# EAGLE design kulgurpowerproto2 (EAGLE 6.3)

## Sheet 1 of 3
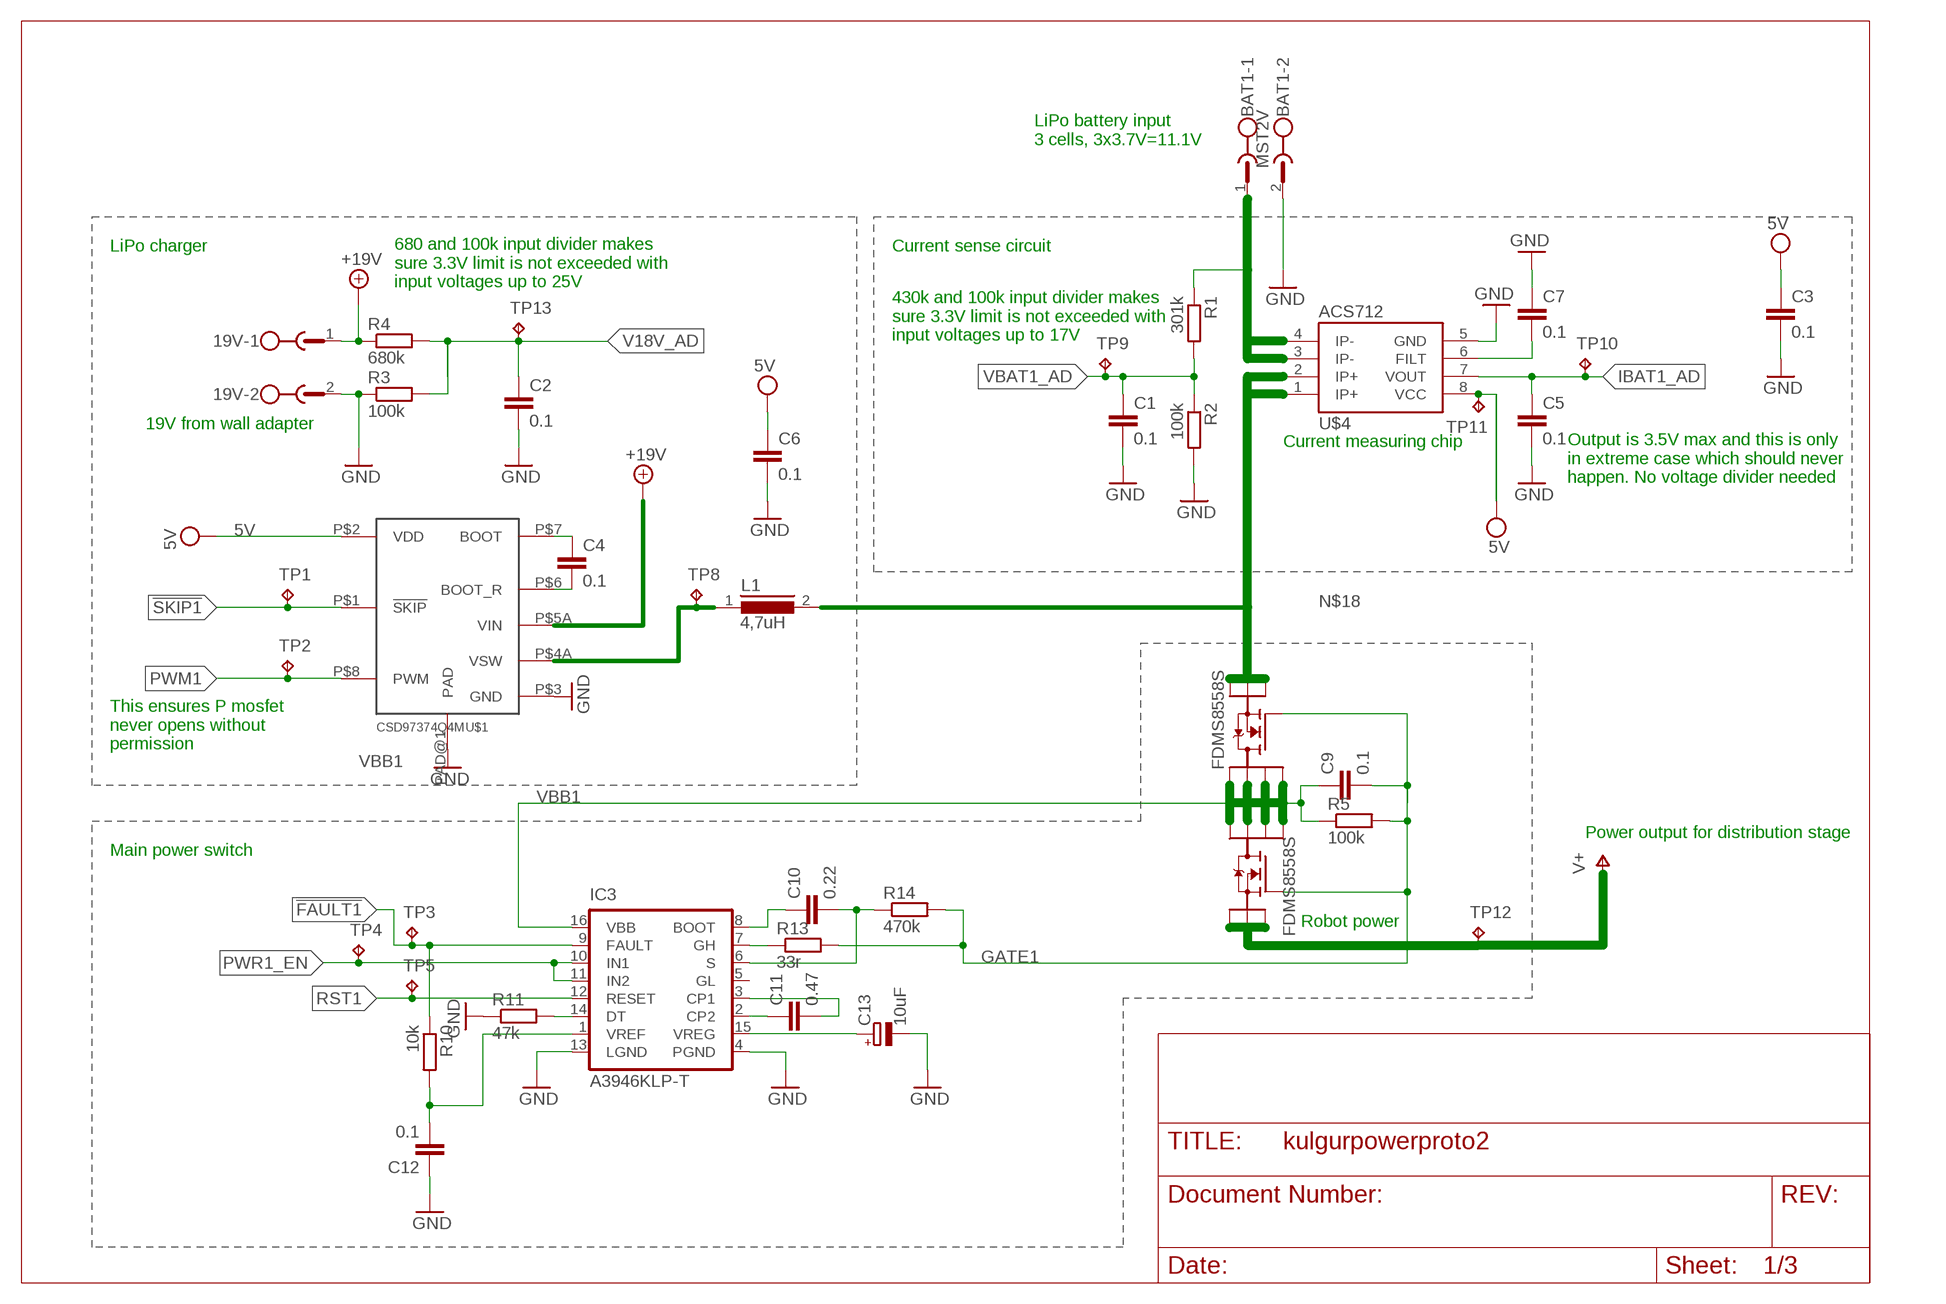
[diagram p0: schematic, sheet 1]

### Parts
19V  MST2V  [MSTBV2]
BAT1  MST2V  [MSTBV2]
C1  0.1  C-EUC0603  [C0603]
C2  0.1  C-EUC0603  [C0603]
C3  0.1  C-EUC0603  [C0603]
C4  0.1  C-EUC0603  [C0603]
C5  0.1  C-EUC0603  [C0603]
C6  0.1  C-EUC0603  [C0603]
C7  0.1  C-EUC0603  [C0603]
C9  0.1  C-EUC0603  [C0603]
C10  0.22  C-EUC0603  [C0603]
C11  0.47  C-EUC0603  [C0603]
C12  0.1  C-EUC0603  [C0603]
C13  10uF  CPOL-EUA/3216-18R  [A/3216-18R]
IC3  A3946KLP-T  [TSSOP16E]
L1  4,7uH  DR73  [DR73]
R1  301k  R-EU_R0603  [R0603]
R2  100k  R-EU_R0603  [R0603]
R3  100k  R-EU_R0603  [R0603]
R4  680k  R-EU_R0603  [R0603]
R5  100k  R-EU_R0603  [R0603]
R10  10k  R-EU_R0603  [R0603]
R11  47k  R-EU_R0603  [R0603]
R13  33r  R-EU_R0603  [R0603]
R14  470k  R-EU_R0603  [R0603]
TP1  TPB2,54  [B2,54]
TP2  TPB2,54  [B2,54]
TP3  TPB2,54  [B2,54]
TP4  TPB2,54  [B2,54]
TP5  TPB2,54  [B2,54]
TP8  TPB2,54  [B2,54]
TP9  TPB2,54  [B2,54]
TP10  TPB2,54  [B2,54]
TP11  TPB2,54  [B2,54]
TP12  TPB2,54  [B2,54]
TP13  TPB2,54  [B2,54]
U$1  CSD97374Q4M  [CSD97374Q4M]
U$2  FDMS8558S  [POWER56]
U$3  FDMS8558S  [POWER56]
U$4  ACS712  [SO08]

### Nets
5V [morepower]: C3.1 C6.1 TP11.TP U$1.P$2(VDD) U$4.8(VCC) ; also sheet 2,3
!FAULT1: IC3.9(FAULT) R10.1 TP3.TP
!SKIP1: TP1.TP U$1.P$1(!SKIP)
+19V [morepower]: 19V.1 R4.1 U$1.P$5A(VIN)
GATE1: C9.2 R5.2 R13.2 R14.2 U$2.P$4(G) U$3.P$4(G)
GND: 19V.2 BAT1.2 C1.2 C2.2 C3.2 C5.2 C6.2 C7.1 C12.1 C13.- IC3.4(PGND) IC3.13(LGND) R2.2 R3.1 R11.1 U$1.P$3(GND) U$1.PAD@1(PAD) U$4.5(GND) ; also sheet 2,3
IBAT1_AD: C5.1 TP10.TP U$4.7(VOUT) ; also sheet 3
N$1: C4.1 U$1.P$7(BOOT)
N$2: C4.2 U$1.P$6(BOOT_R)
N$15 [morepower]: L1.1 TP8.TP U$1.P$4A(VSW)
N$17: C10.1 IC3.8(BOOT)
N$18 [morepower]: L1.2 U$2.P$1(S1) U$2.P$2(S2) U$2.P$3(S3) U$4.1(IP+) U$4.2(IP+)
N$20: C10.2 IC3.6(S) R14.1
N$21: C7.2 U$4.6(FILT)
N$24 [morepower]: BAT1.1 R1.1 U$4.3(IP-) U$4.4(IP-)
N$27: C11.1 IC3.2(CP2)
N$28: C11.2 IC3.3(CP1)
N$30: C12.2 IC3.1(VREF) R10.2
N$31: IC3.7(GH) R13.1
N$32: IC3.14(DT) R11.2
N$33: C13.+ IC3.15(VREG)
PWM1: TP2.TP U$1.P$8(PWM)
PWR1_EN: IC3.10(IN1) IC3.11(IN2) TP4.TP ; also sheet 3
RST1: IC3.12(RESET) TP5.TP
V18V_AD: C2.1 R3.2 R4.2 TP13.TP
V+ [morepower]: TP12.TP U$3.P$1(S1) U$3.P$2(S2) U$3.P$3(S3)
VBAT1_AD: C1.1 R1.2 R2.1 TP9.TP ; also sheet 3
VBB1 [morepower]: C9.1 IC3.16(VBB) R5.1 U$2.P$5(D4) U$2.P$6(D3) U$2.P$7(D2) U$2.P$8(D1) U$3.P$5(D4) U$3.P$6(D3) U$3.P$7(D2) U$3.P$8(D1)
Unconnected: IC3.5(GL)

### Notes on the sheet
- LiPo battery input
  3 cells, 3x3.7V=11.1V
- LiPo charger | Current sense circuit
- 680 and 100k input divider makes
  sure 3.3V limit is not exceeded with 
  input voltages up to 25V
- 430k and 100k input divider makes
  sure 3.3V limit is not exceeded with 
  input voltages up to 17V
- 19V from wall adapter
- Current measuring chip
- Output is 3.5V max and this is only
  in extreme case which should never 
  happen. No voltage divider needed
- This ensures P mosfet
  never opens without 
  permission
- Power output for distribution stage
- Main power switch
- Robot power

## Sheet 2 of 3
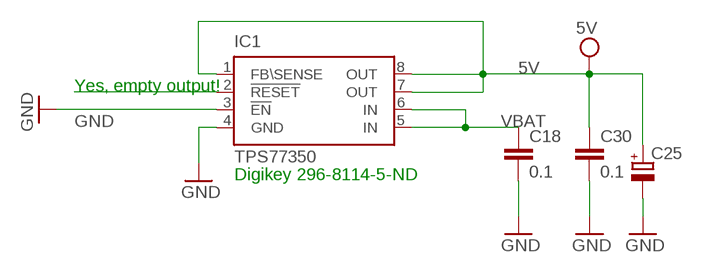
[diagram p1: schematic, sheet 2]

### Parts
C18  0.1  CAP0603-CAP  [0603-CAP]
C25  CPOL-EUD/7343-31R  [D/7343-31R]
C30  0.1  CAP0603-CAP  [0603-CAP]
IC1  TPS77350  TPS773  [MSOP8]

### Nets
5V [morepower]: C25.+ C30.1 IC1.1(FB\SENSE) IC1.7(OUT) IC1.8(OUT) ; also sheet 1,3
GND: C18.2 C25.- C30.2 IC1.3(!EN) IC1.4(GND) ; also sheet 1,3
N$9: IC1.2(!RESET)
VBAT [morepower]: C18.1 IC1.5(IN) IC1.6(IN)

### Notes on the sheet
- Yes, empty output!
- Digikey 296-8114-5-ND

## Sheet 3 of 3
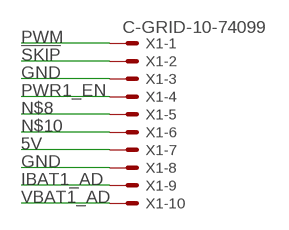
[diagram p2: schematic, sheet 3]

### Parts
X1  C-GRID-10-74099  [74099-10]

### Nets
5V [morepower]: X1.7 ; also sheet 1,2
!SKIP: X1.2
GND: X1.3 X1.8 ; also sheet 1,2
IBAT1_AD: X1.9 ; also sheet 1
N$8: X1.5
N$10: X1.6
PWM: X1.1
PWR1_EN: X1.4 ; also sheet 1
VBAT1_AD: X1.10 ; also sheet 1

## Library data of the parts
19V BAT1 = con-phoenix-508:MST2V: PHOENIX; OC_FARNELL: unknown; OC_NEWARK: unknown
C1-C7 = rcl:C-EU: CAPACITOR, European symbol
C9-C12 = resistor:C-EU: CAPACITOR, European symbol
C13 = resistor:CPOL-EU: POLARIZED CAPACITOR, European symbol
C18 C30 = SparkFun:CAP: Capacitor Standard 0603 ceramic capacitor, and 0.1" leaded capacitor.
C25 = rcl:CPOL-EU: POLARIZED CAPACITOR, European symbol
IC1 = samuel:TPS773*: 250-mA LDO REGULATORS WITH RESET OUTPUT WITH 8-PIN MSOP PACKAGING Source: http://focus.ti.com/lit/ds/symlink/tps77333.pdf
IC3 = allegro:A3946: Half-Bridge Power MOSFET Controller Source: Data sheet <http://www.allegromicro.com/Products/Motor-Driver-And-Interface-ICs/Brushless-DC-Motor-Drivers/A3946.aspx>
L1 = inductors:DR73: High Power Density, High Efficiency, Shielded Inductors Source: coiltronics_dr_series.pdf
R1-R5 R10 R11 R13 R14 = rcl:R-EU_: RESISTOR, European symbol
TP1-TP5 TP8-TP13 = testpad:TP: Test pad
U$1 = CSD97374Q4M:CSD97374Q4M
U$2 U$3 = FDMS8558S:FDMS8558S
U$4 = SparkFun-AnalogIC:ACS712: Hall-effect-based isolated linear current sensor
X1 = con-molex:C-GRID-10: CONNECTOR wire to board 2.54 mm (0.100") pitch header; OC_FARNELL: unknown; OC_NEWARK: unknown

## Net classes
0 default: width 0.2 mm, drill 0.3 mm, clearance 0.15 mm
1 power: width 1 mm, drill 0.5 mm, clearance 0.15 mm
2 morepower: width 1 mm, drill 1 mm, clearance 0.15 mm

## Board
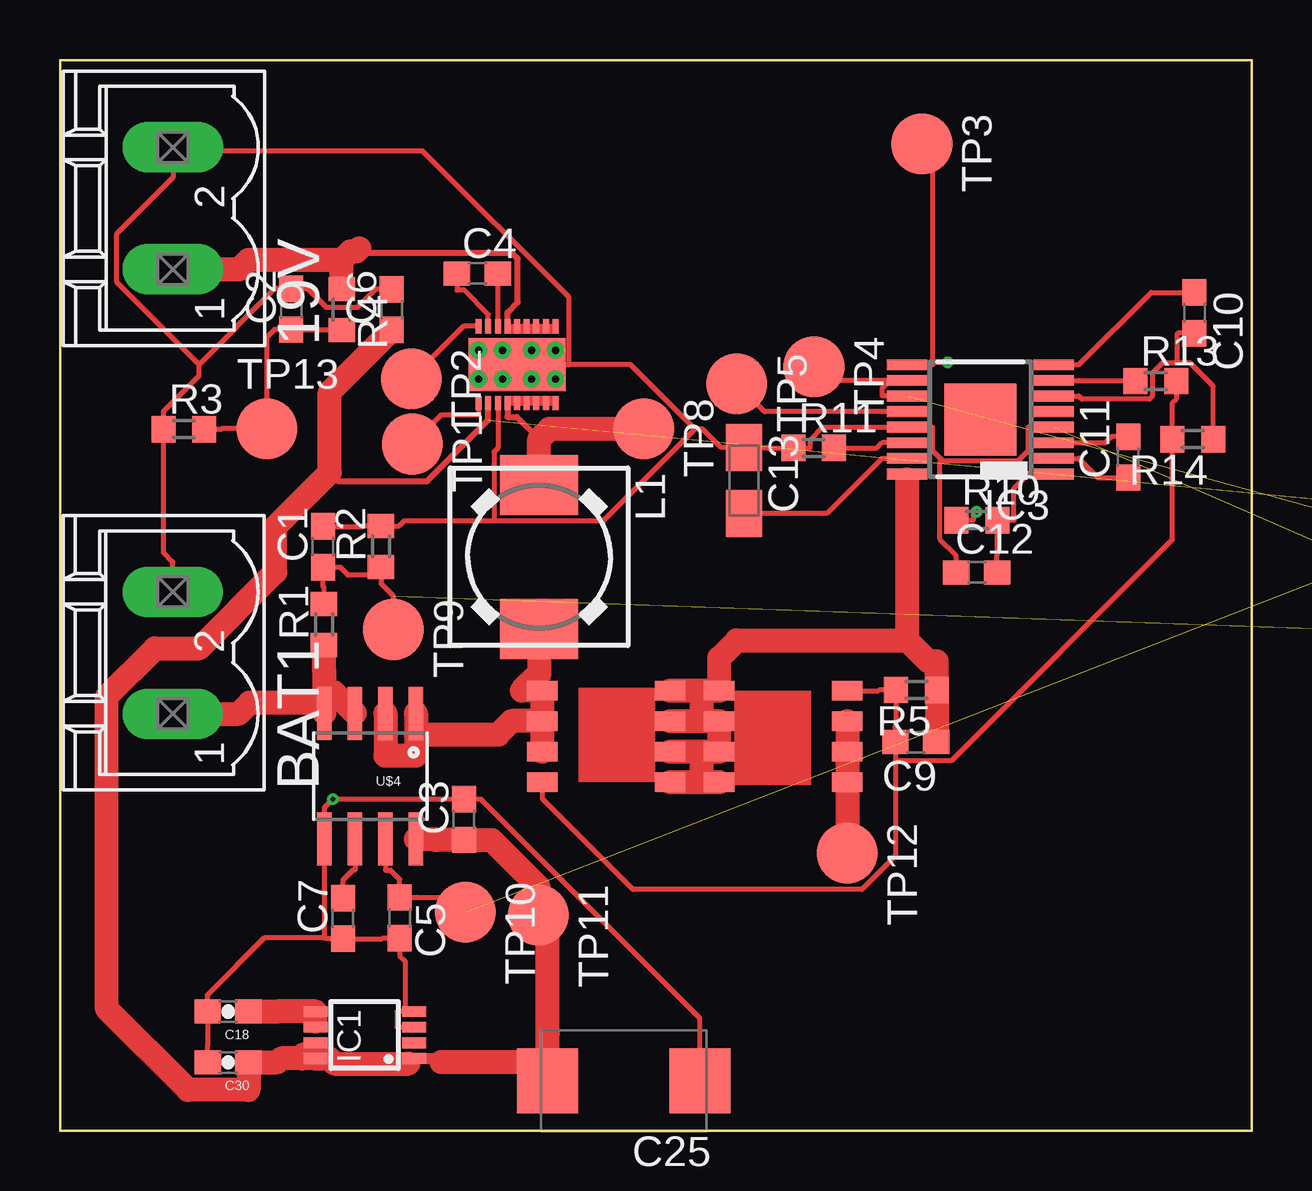
[diagram p3: board, top side]
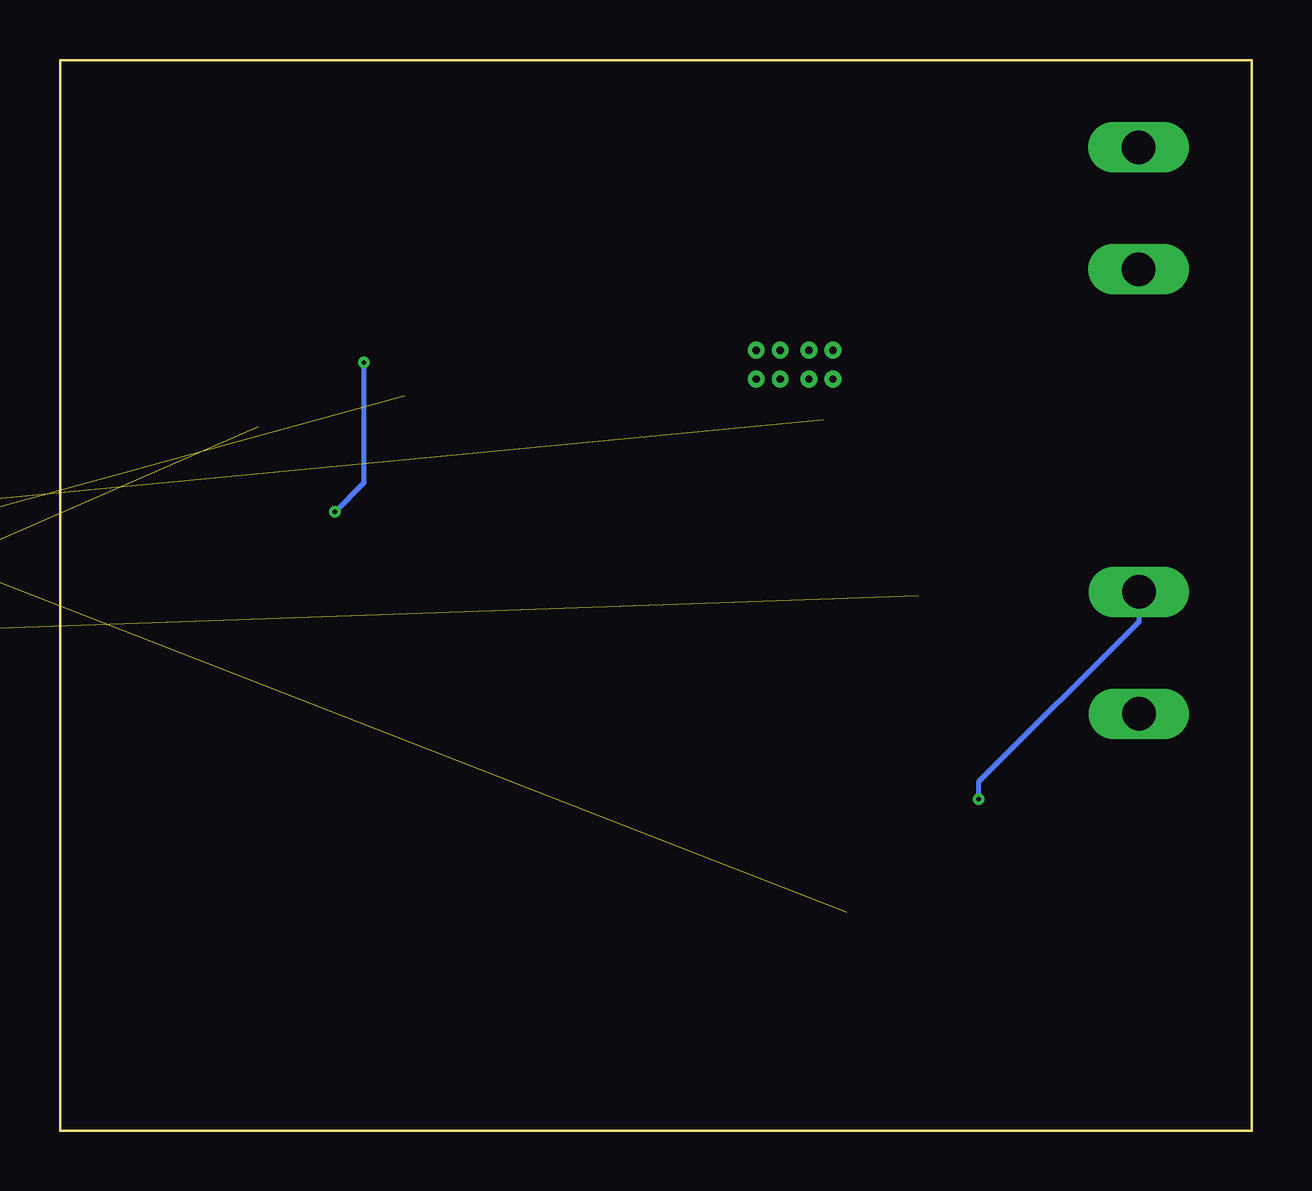
[diagram p4: board, bottom side, seen from below]

Size 49.67 x 44.63 mm. Coordinates in mm from the lower left corner, seen from the top.
Outline: 0,44.63 49.67,44.63 49.67,0 0,0 0,44.63
Copper layers (1*16): Top 0.035mm / dielectric 0.6mm / Bottom 0.035mm
Design rules "4mil_4lay2 *": minimum track width 4mil, minimum drill 7mil, track to track 4mil, track to pad 4mil, pad to pad 4mil, via to via 4mil, smd to smd 0mil, copper to edge 20mil, drill to drill 8mil, minimum pad ring 8mil, minimum via ring 6mil, stop-mask expansion 4mil, vias tented up to drill 18mil, thermal gap 10mil

### Footprints (pad centres in the part's own frame; a part is rotated, then mirrored left to right if it is on the bottom)
MSTBV2 = drill 1.397 long: 1 -2.54,0; 2 2.54,0
C0603 = smd 1.1 x 1: 1 -0.85,0; 2 0.85,0
A/3216-18R = smd 1.95 x 1.5: + 1.375,0; - -1.375,0
0603-CAP = smd 1.1 x 1: 1 -0.85,0; 2 0.85,0
D/7343-31R = smd 2.55 x 2.7: + 3.175,0; - -3.175,0
MSOP8 = smd 0.45 x 1: 1 -0.975,-2.05; 2 -0.325,-2.05; 3 0.325,-2.05; 4 0.975,-2.05; 5 0.975,2.05; 6 0.325,2.05; 7 -0.325,2.05; 8 -0.975,2.05
TSSOP16E = smd 0.45 x 1.7: 1 -2.275,-3.05; 2 -1.625,-3.05; 3 -0.975,-3.05; 4 -0.325,-3.05; 5 0.325,-3.05; 6 0.975,-3.05; 7 1.625,-3.05; 8 2.275,-3.05; 9 2.275,3.05; 10 1.625,3.05; 11 0.975,3.05; 12 0.325,3.05; 13 -0.325,3.05; 14 -0.975,3.05; 15 -1.625,3.05; 16 -2.275,3.05 | smd 3 x 3: EXP 0,0
DR73 = smd 2.5 x 3.25: 1 -3,0; 2 3,0
R0603 = smd 1 x 1.1: 1 -0.85,0; 2 0.85,0
B2,54 = smd 2.54 x 2.54: TP 0,0
CSD97374Q4M = smd 0.25 x 0.6: P$1 -1.6,-1.6; P$2 -1.2,-1.6; P$3 -0.8,-1.6; P$4A -0.4,-1.6; P$4B 0,-1.6; P$4C 0.4,-1.6; P$4D 0.8,-1.6; P$4E 1.2,-1.6; P$4F 1.6,-1.6; P$5A -0.4,1.6; P$5B 0,1.6; P$5C 0.4,1.6; P$5D 0.8,1.6; P$5E 1.2,1.6; P$5F 1.6,1.6; P$6 -0.8,1.6; P$7 -1.2,1.6; P$8 -1.6,1.6 | smd 4.05 x 2.2: PAD@1 0,0 | drill 0.3: PAD@3 -0.6,0.6; PAD@4 -0.6,-0.6; PAD@5 0.6,0.6; PAD@6 0.6,-0.6; PAD@9 -1.6,0.6; PAD@10 -1.6,-0.6; PAD@11 1.6,0.6; PAD@12 1.6,-0.6
POWER56 = smd 0.81 x 1.27: P$1 -1.905,-2.67; P$2 -0.635,-2.67; P$3 0.635,-2.67; P$4 1.905,-2.67; P$5 1.905,2.67; P$6 0.635,2.67; P$7 -0.635,2.67; P$8 -1.905,2.67
SO08 = smd 0.61 x 2.21: 1 -1.905,-2.616; 2 -0.635,-2.616; 3 0.635,-2.616; 4 1.905,-2.616; 5 1.905,2.616; 6 0.635,2.616; 7 -0.635,2.616; 8 -1.905,2.616
74099-10 = smd 1.27 x 3.175: 1 -11.43,-2.223; 2 -8.89,2.223; 3 -6.35,-2.223; 4 -3.81,2.223; 5 -1.27,-2.223; 6 1.27,2.223; 7 3.81,-2.223; 8 6.35,2.223; 9 8.89,-2.223; 10 11.43,2.223

### Placement (x,y rotation side)
19V  4.71,38.45 90 top
BAT1  4.7,19.92 90 top
C1  10.97,24.34 90 top
C2  9.64,34.24 90 top
C3  16.84,12.97 90 top
C4  17.4,35.73 0 top
C5  14.16,8.88 270 top
C6  13.83,34.22 90 top
C7  11.8,8.85 90 top
C9  35.67,16.2 180 top
C10  47.28,34.09 270 top
C11  44.52,28.07 90 top
C12  38.21,23.27 0 top
C13  28.51,27.1 270 top
C18  7.01,4.97 180 top
C25  23.5,2.08 180 top
C30  7.01,2.85 180 top
IC1  12.7,3.99 90 top
IC3  38.36,29.65 90 top
L1  19.97,23.92 270 top
R1  11,21.1 90 top
R2  13.38,24.35 90 top
R3  5.17,29.24 0 top
R4  11.74,34.23 270 top
R5  35.69,18.37 180 top
R10  38.22,25.45 0 top
R11  31.42,28.46 0 top
R13  45.68,31.24 0 top
R14  47.22,28.82 180 top
TP1  14.69,28.62 270 top
TP2  14.64,31.34 270 top
TP3  35.93,41.14 270 top
TP4  31.43,31.84 270 top
TP5  28.21,31.13 270 top
TP8  24.33,29.25 270 top
TP9  13.9,20.89 270 top
TP10  16.89,9.11 270 top
TP11  19.94,8.98 270 top
TP12  32.82,11.57 270 top
TP13  8.63,29.26 0 top
U$1  19.05,31.93 0 top
U$2  22.77,16.44 270 top
U$3  30.15,16.43 90 top
U$4  12.93,14.78 180 top
X1  67.31,23.04 180 top  (outside the outline)

### Tracks (layer width: path | path; a pad name or v marks a point on that pad's centre or on a via)
5V  (1 unrouted)
  Top 0.25: 11.24,27.44 11.61,27.07 15.31,27.07 17.85,29.61 U$1.P$2
  Top 0.45: 10.16,3.17 IC1.7 | 14.53,2.79 IC1.1 15.62,3.02 15.79,2.85 15.9,2.85
  Top 1: C6.1 11.24,30.78 11.24,27.44 8.98,25.17 8.98,23.28 5.79,20.1 3.97,20.1 1.95,18.09 1.95,5.08 5.34,1.7 7.86,1.7 C30.1 9.06,2.85 9.23,3.02 10.07,3.02 | 10.07,3.02 10.07,3.09 10.16,3.17 | 10.07,3.02 IC1.8 11.22,3.02 11.45,2.79 14.53,2.79 | 20.32,2.85 20.32,4.08 20.32,8.61 TP11.TP 19.94,10.16 17.99,12.12 C3.1 15.69,12.12 15.65,12.16 U$4.8 | C25.+ 20.32,2.85 | 20.32,2.85 15.9,2.85
!FAULT1  (via drill 0.18 pad 0.48)
  Top 0.2: R10.1 38.07,25.45 38.07,25.65 v38.21,25.79 | v37.01,32.02 36.37,32.02 | 36.37,32.02 36.37,31.92 IC3.9 | TP3.TP 36.37,40.7 36.37,32.02
  Bottom 0.2: v37.01,32.02 37.01,27 v38.21,25.79
!SKIP1
  Top 0.2: U$1.P$1 17.45,29.83 15.89,29.83 TP1.TP
+19V
  Top 0.25: 12.48,36.77 12.66,36.59 18.84,36.59 19.07,36.35 19.07,34.53 18.65,34.1 U$1.P$5A
  Top 1: 11.74,36.29 12.1,36.65 12.36,36.65 12.48,36.77 | 11.74,36.29 11.74,36.23 R4.1 | 11.74,36.29 7.84,36.29 7.46,35.91 19V.1
GATE1
  Top 0.2: R13.2 46.52,30.49 46.37,30.34 R14.2 46.37,24.64 37.18,15.44 34.82,15.44 | 34.82,15.44 34.82,11.45 33.42,10.05 23.89,10.05 20.11,13.84 U$2.P$4 | 34.82,15.44 C9.2 34.82,16.9 34.84,16.92 34.84,17.62 R5.2 34.14,18.37 34.11,18.33 U$3.P$4
GND  (via drill 0.18 pad 0.48)  (2 unrouted)
  Top 0.2: 18.09,25.42 14.35,25.42 14.13,25.2 R2.2 12.63,25.2 12.62,25.19 11.67,25.19 C1.2 | 26.46,29.25 22.63,25.42 18.09,25.42 | U$1.P$3 18.25,28.45 18.09,28.29 18.09,25.42 | 26.46,29.25 26.78,29.25 27.56,28.48 C13.- 29.46,28.48 29.48,28.46 R11.1 31.27,28.46 31.27,28.79 31.8,29.32 IC3.13 36.37,29.32 36.37,28.36 36.78,27.94 | 26.46,29.25 23.79,31.93 21.21,31.93 | U$1.PAD@1 21.21,31.93 | 21.21,31.93 21.21,34.74 15.12,40.84 4.71,40.84 | 4.71,40.84 4.71,39.74 2.37,37.39 2.37,35.37 5.79,31.94 | 19V.2 4.71,40.84 | 5.79,31.94 8.94,35.09 C2.2 10,35.09 10.35,35.09 10.35,35.07 11.09,34.33 12.4,34.33 13.13,35.05 13.13,35.07 C6.2 | 5.79,31.94 5.79,31.47 4.32,29.99 R3.1 4.32,24.09 4.7,23.71 BAT1.2 | 11.03,8.03 U$4.5 11.03,13.47 v11.38,13.82 C3.2 17.54,13.82 26.67,4.69 C25.- | 11.03,8.03 8.52,8.03 6.16,5.67 C18.2 6.16,3.56 6.16,3.55 C30.2 | 11.03,8.03 11.06,8.03 11.09,8 C7.1 13.43,8 13.46,8.03 C5.2 14.16,7.27 14.4,7.04 14.4,4.96 | 36.78,27.94 39.95,27.94 40.36,28.36 40.36,29.32 IC3.4 | 36.78,27.94 36.67,27.82 36.67,24.67 37.36,23.97 C12.1 | 14.4,4.96 14.05,4.96 14.05,4.31 IC1.3 | IC1.4 14.4,4.96
  Bottom 0.2: BAT1.2 4.7,21.21 11.38,14.53 v11.38,13.82
IBAT1_AD  (1 unrouted)
  Top 0.2: TP10.TP 16.27,9.73 14.86,9.73 C5.1 14.16,10.48 13.79,10.85 13.57,10.85 U$4.7
N$1
  Top 0.2: C4.1 16.55,35.03 16.86,35.03 17.85,34.03 U$1.P$7
N$2
  Top 0.2: C4.2 18.25,35.03 18.25,35.02 18.25,34.03 U$1.P$6
N$15
  Top 0.25: 19.97,28.82 19.04,29.75 18.65,29.75 U$1.P$4A
  Top 1: TP8.TP 20.4,29.25 19.97,28.82 L1.1
N$17
  Top 0.2: IC3.8 42.47,31.92 45.48,34.94 C10.1
N$18
  Top 1: U$2.P$3 U$2.P$2 | U$2.P$2 18.82,17.07 18.26,16.51 14.84,16.51 | 14.84,16.51 14.84,15.64 13.57,15.64 U$4.2 | U$4.1 14.84,16.51 | U$2.P$2 U$2.P$1 19.24,18.34 19.92,19.02 19.97,19.02 L1.2
N$20
  Top 0.2: 46.58,32 45.94,32 45.53,31.58 45.53,30.61 45.41,30.49 42.59,30.49 42.47,30.62 IC3.6 | R14.1 48.07,31.03 47.11,32 46.58,32 | 46.58,32 46.58,33.24 C10.2
N$21
  Top 0.2: U$4.6 12.3,10.85 12.2,10.85 11.8,10.45 C7.2
N$24
  Top 1: BAT1.1 7.45,17.38 7.9,17.83 11.03,17.83 | 11.03,17.83 11.03,18.27 | U$4.4 11.03,17.83 | 11.03,18.27 11.42,18.27 U$4.3 | 11.03,18.27 11.03,19.15 11,19.17 R1.1
N$27
  Top 0.2: C11.1 43.27,27.22 42.47,28.02 IC3.2
N$28
  Top 0.2: C11.2 43.82,28.92 43.57,28.67 42.47,28.67 IC3.3
N$30
  Top 0.2: C12.2 39.06,23.97 39.07,23.98 R10.2 39.77,25.45 39.77,26.78 40.36,27.37 IC3.1
N$31
  Top 0.2: IC3.7 42.47,31.27 42.49,31.25 R13.1
N$32
  Top 0.2: IC3.14 34.26,28.67 34.04,28.46 R11.2
N$33
  Top 0.2: IC3.15 34.26,28.02 31.96,25.73 C13.+
PWM1
  Top 0.2: U$1.P$8 16.83,33.53 TP2.TP
PWR1_EN  (1 unrouted)
  Top 0.2: 34.66,31.27 31.99,31.27 TP4.TP | IC3.11 34.26,30.62 34.26,30.94 34.6,31.27 34.66,31.27 | 34.66,31.27 IC3.10
RST1
  Top 0.2: TP5.TP 29.37,29.97 34.26,29.97 IC3.12
V18V_AD
  Top 0.2: R3.2 6.72,29.24 6.74,29.26 TP13.TP 8.63,33.08 8.94,33.39 C2.1 10.35,33.39 10.36,33.38 R4.2
V+
  Top 1: TP12.TP U$3.P$1 U$3.P$2 U$3.P$3
VBAT
  Top 0.45: 10.65,4.54 IC1.6
  Top 1: C18.1 9.06,4.97 9.06,4.96 IC1.5 10.65,4.54
VBAT1_AD  (1 unrouted)
  Top 0.2: R1.2 11,22.65 10.97,22.68 C1.1 11.67,23.49 12.01,23.15 13.38,23.15 | 13.38,23.15 13.38,22.8 13.9,22.29 TP9.TP | R2.1 13.38,23.15
VBB1
  Top 0.45: 35.31,27.15 IC3.16
  Top 1: 35.31,20.44 36.18,19.57 36.54,19.57 R5.1 36.54,17.17 36.54,16.22 C9.1 | 35.31,20.44 28.21,20.44 27.48,19.71 U$3.P$5 26.74,18.33 | 35.31,20.44 35.31,27.15 | 26.74,17.08 26.76,17.06 U$3.P$6 U$3.P$7 26.74,15.79 | 26.74,17.08 26.73,17.07 U$2.P$7 | 26.74,18.33 26.74,17.08 | 26.74,15.79 26.73,15.8 U$2.P$6 | 26.74,15.79 26.74,14.54 26.73,14.53 | 26.74,18.33 26.73,18.34 U$2.P$8 | U$2.P$5 26.73,14.53 | U$3.P$8 26.74,14.52 26.73,14.53